# EAGLE design IOB-I2C-PCA9685-PWM (EAGLE 7.7.0)
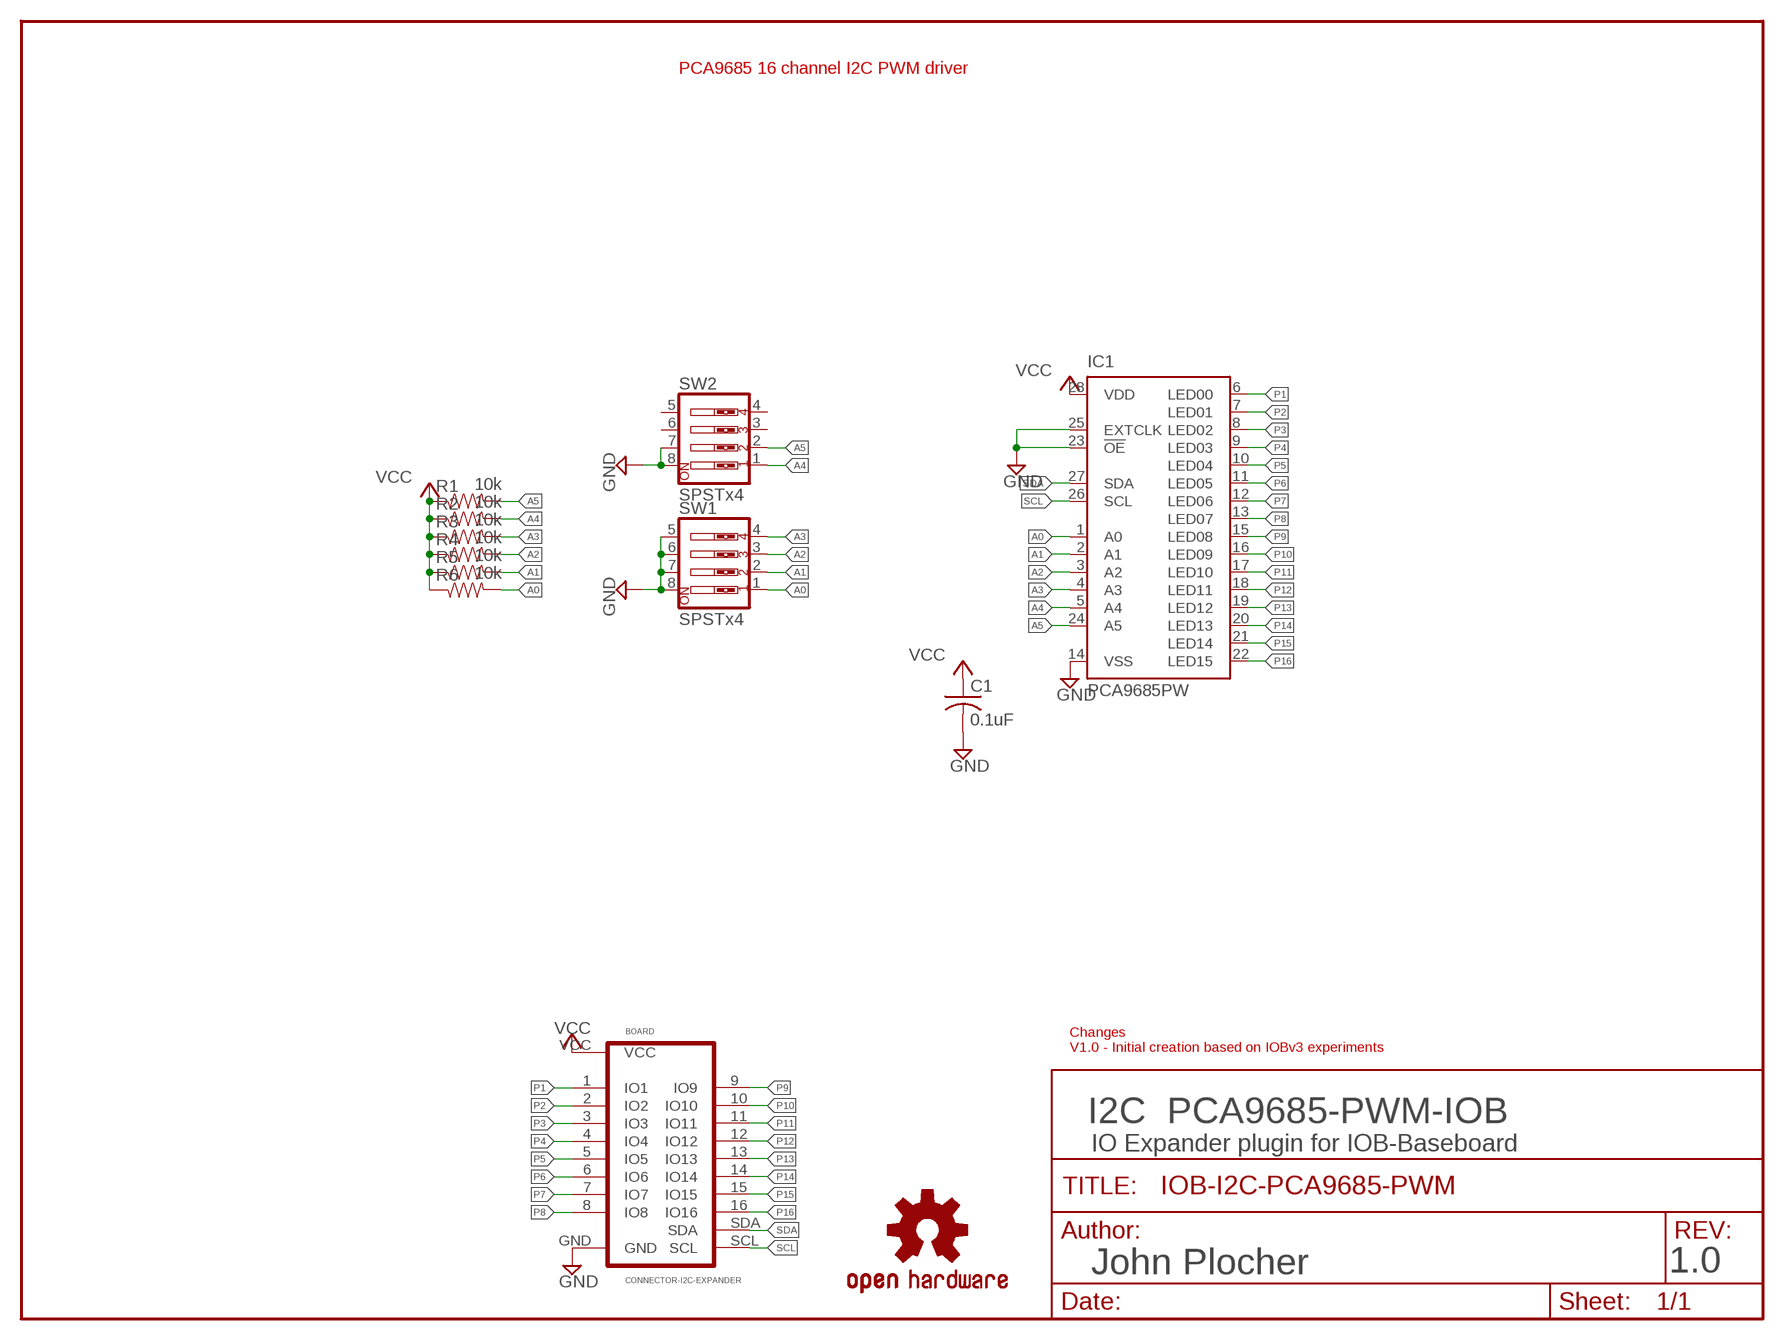
[diagram p0: schematic, sheet 1]

## Parts
BOARD  CONNECTOR-I2C-EXPANDER  [I2C-EXPANDER]
C1  0.1uF  CAP0603  [0603-CAP]
IC1  PCA9685PW  [TSSOP28]
R1  10k  R0603-RES  [0603-RES]
R2  10k  R0603-RES  [0603-RES]
R3  10k  R0603-RES  [0603-RES]
R4  10k  R0603-RES  [0603-RES]
R5  10k  R0603-RES  [0603-RES]
R6  10k  R0603-RES  [0603-RES]
SW1  SPSTx4  SW_DIP-4  [EDG-04]
SW2  SPSTx4  SW_DIP-4  [EDG-04]
U$1  OSHW  DOC-OSHW-LOGO-L  [OSHW-LOGO-L]

## Nets
A0 [signals]: IC1.1(A0) R6.2 SW1.1
A1 [signals]: IC1.2(A1) R5.2 SW1.2
A2 [signals]: IC1.3(A2) R4.2 SW1.3
A3: IC1.4(A3) R3.2 SW1.4
A4: IC1.5(A4) R2.2 SW2.1
A5: IC1.24(A5) R1.2 SW2.2
GND [Power]: BOARD.GND C1.2 IC1.14(VSS) IC1.23(!OE) IC1.25(EXTCLK) SW1.5 SW1.6 SW1.7 SW1.8 SW2.7 SW2.8
P1 [signals]: BOARD.1(IO1) IC1.6(LED00)
P2 [signals]: BOARD.2(IO2) IC1.7(LED01)
P3 [signals]: BOARD.3(IO3) IC1.8(LED02)
P4 [signals]: BOARD.4(IO4) IC1.9(LED03)
P5 [signals]: BOARD.5(IO5) IC1.10(LED04)
P6 [signals]: BOARD.6(IO6) IC1.11(LED05)
P7 [signals]: BOARD.7(IO7) IC1.12(LED06)
P8 [signals]: BOARD.8(IO8) IC1.13(LED07)
P9 [signals]: BOARD.9(IO9) IC1.15(LED08)
P10 [signals]: BOARD.10(IO10) IC1.16(LED09)
P11 [signals]: BOARD.11(IO11) IC1.17(LED10)
P12 [signals]: BOARD.12(IO12) IC1.18(LED11)
P13 [signals]: BOARD.13(IO13) IC1.19(LED12)
P14 [signals]: BOARD.14(IO14) IC1.20(LED13)
P15 [signals]: BOARD.15(IO15) IC1.21(LED14)
P16 [signals]: BOARD.16(IO16) IC1.22(LED15)
SCL [signals]: BOARD.SCL IC1.26(SCL)
SDA [signals]: BOARD.SDA IC1.27(SDA)
VCC [Power]: BOARD.VCC C1.1 IC1.28(VDD) R1.1 R2.1 R3.1 R4.1 R5.1 R6.1
Unconnected: SW2.3 SW2.4 SW2.5 SW2.6

## Notes on the sheet
- PCA9685 16 channel I2C PWM driver
- Changes
  V1.0 - Initial creation based on IOBv3 experiments
- I2C  PCA9685-PWM-IOB
- IO Expander plugin for IOB-Baseboard
- John Plocher | 1.0

## Library data of the parts
BOARD = SPCoast:CONNECTOR-I2C-EXPANDER
C1 = SPCoast:CAP*
IC1 = SPCoast:PCA9685
R1-R6 = SPCoast:R*: Resistor Basic schematic elements and footprints for 0603, 1206, and PTH 1/10th watt (small) resistors.
SW1 SW2 = SPCoast:SW_DIP-4: DIP SWITCH
U$1 = SPCoast:DOC-OSHW-LOGO-: Open Source Hardware Logo This logo indicates the piece of hardware it is found on incorporates a OSHW license and/or adheres to the definition of open source hardware http://freedomdefined.org/OSHW Creative Commons - Attribution - ShareAlike 3.0

## Net classes
0 default: width 0.254 mm, drill 0.4 mm, clearance 0.127 mm
1 Power: width 0.254 mm, drill 0.4 mm, clearance 0.127 mm
2 signals: width 0.254 mm, drill 0.4 mm, clearance 0.127 mm

## Board
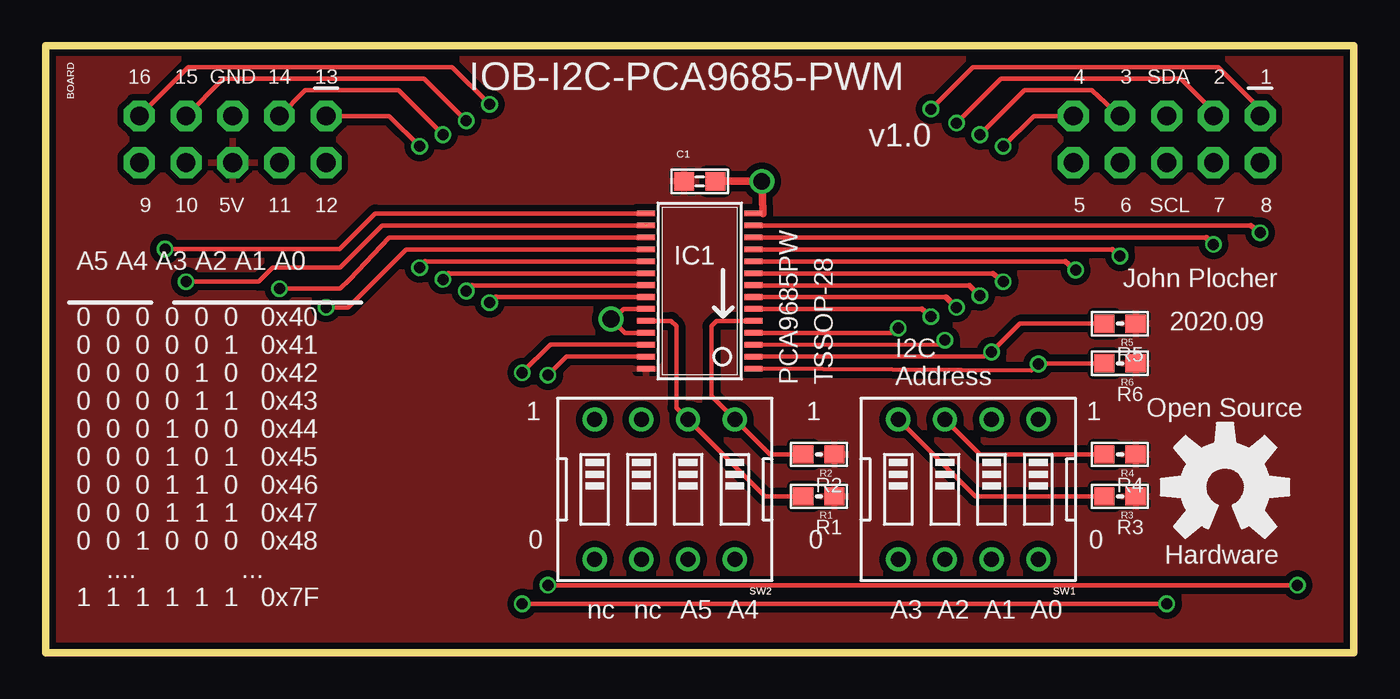
[diagram p1: board, top side]
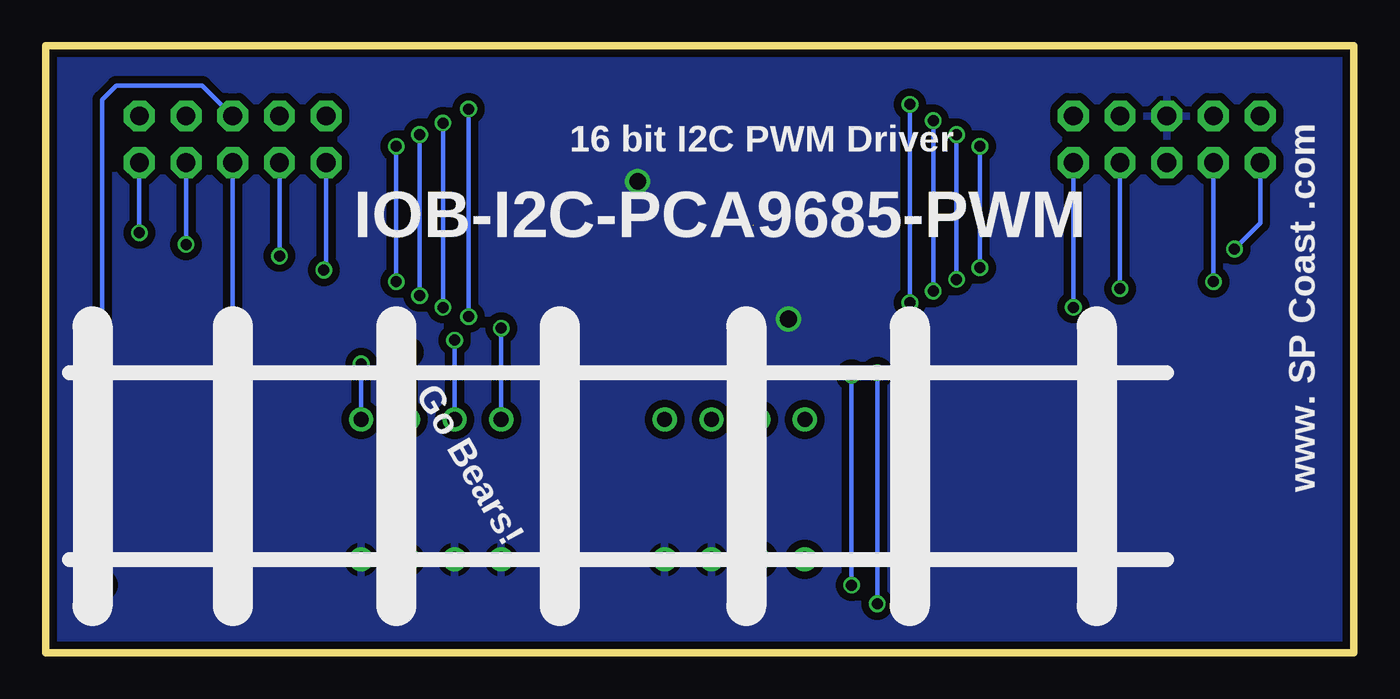
[diagram p2: board, bottom side, seen from below]

Size 71.12 x 33.02 mm. Coordinates in mm from the lower left corner, seen from the top.
Outline: 0,33.02 0,0 71.12,0 71.12,33.02 0,33.02
Copper layers (1*16): Top 0.035mm / dielectric 1.5mm / Bottom 0.035mm
Design rules "Fusion_eagle_rule_v1.1": minimum track width 6mil, minimum drill 12mil, track to track 6mil, track to pad 6mil, pad to pad 6mil, via to via 6mil, smd to smd 0mil, copper to edge 10mil, drill to drill 10mil, minimum pad ring 10mil, minimum via ring 6mil, stop-mask expansion 2mil, vias tented up to drill 100mil, thermal gap 10mil

### Footprints (pad centres in the part's own frame; a part is rotated, then mirrored left to right if it is on the bottom)
I2C-EXPANDER = drill 1.016 pad 1.676 octagon: 1 30.48,1.27; 2 27.94,1.27; 3 22.86,1.27; 4 20.32,1.27; 5 20.32,-1.27; 6 22.86,-1.27; 7 27.94,-1.27; 8 30.48,-1.27; 9 -30.48,-1.27; 10 -27.94,-1.27; 11 -22.86,-1.27; 12 -20.32,-1.27; 13 -20.32,1.27; 14 -22.86,1.27; 15 -27.94,1.27; 16 -30.48,1.27; GND -25.4,1.27; SCL 25.4,-1.27; SDA 25.4,1.27; VCC -25.4,-1.27
0603-CAP = smd 1.1 x 1: 1 -0.85,0; 2 0.85,0
TSSOP28 = smd 0.305 x 0.991: 1 -4.225,-2.918; 2 -3.575,-2.918; 3 -2.925,-2.918; 4 -2.275,-2.918; 5 -1.625,-2.918; 6 -0.975,-2.918; 7 -0.325,-2.918; 8 0.325,-2.918; 9 0.975,-2.918; 10 1.625,-2.918; 11 2.275,-2.918; 12 2.925,-2.918; 13 3.575,-2.918; 14 4.225,-2.918; 15 4.225,2.918; 16 3.575,2.918; 17 2.925,2.918; 18 2.275,2.918; 19 1.625,2.918; 20 0.975,2.918; 21 0.325,2.918; 22 -0.325,2.918; 23 -0.975,2.918; 24 -1.625,2.918; 25 -2.275,2.918; 26 -2.925,2.918; 27 -3.575,2.918; 28 -4.225,2.918
0603-RES = smd 1.1 x 1: 1 -0.85,0; 2 0.85,0
EDG-04 = drill 0.813: 1 -3.81,-3.81; 2 -1.27,-3.81; 3 1.27,-3.81; 4 3.81,-3.81; 5 3.81,3.81; 6 1.27,3.81; 7 -1.27,3.81; 8 -3.81,3.81

### Placement (x,y rotation side)
BOARD  35.56,27.94 0 top
C1  35.56,25.65 0 top
IC1  35.56,19.68 90 top
R1  42.04,8.51 180 top
R2  42.04,10.79 180 top
R3  58.42,8.51 180 top
R4  58.42,10.79 180 top
R5  58.42,17.91 180 top
R6  58.42,15.75 180 top
SW1  50.16,8.89 180 top
SW2  33.66,8.89 180 top
U$1  64.14,9.02 0 top

### Tracks (layer width: path | path; a pad name or v marks a point on that pad's centre or on a via)
A0  (via drill 0.6)
  Top 0.254: IC1.1 53.59,15.37 53.94,15.71 v53.98,15.71 54.01,15.75 R6.2
  Bottom 0.254: v53.98,15.71 SW1.1
A1  (via drill 0.6)
  Top 0.254: IC1.2 51.05,16.13 51.29,16.36 v51.44,16.36 52.98,17.91 R5.2
  Bottom 0.254: v51.44,16.36 SW1.2
A2  (via drill 0.6)
  Top 0.254: IC1.3 48.51,16.76 48.76,17.01 v48.9,17.01 | R4.2 50.8,10.79 SW1.3
  Bottom 0.254: v48.9,17.01 SW1.3
A3  (via drill 0.6)
  Top 0.254: IC1.4 45.97,17.4 46.24,17.66 v46.35,17.66 | R3.2 50.55,8.51 SW1.4
  Bottom 0.254: v46.35,17.66 SW1.4
A4
  Top 0.254: IC1.5 36.48,18.06 36.2,17.78 36.2,13.97 SW2.1 39.37,10.79 R2.2
A5
  Top 0.254: IC1.24 34.01,18.06 34.29,17.78 34.29,13.34 SW2.2 39.12,8.51 R1.2
GND  (via drill 0.9)
  Top 0.254: IC1.25 31.48,17.41 31.11,17.78 | 31.11,17.78 31.11,18.41 31.41,18.71 IC1.23 | v30.73,18.16 31.11,17.78 | IC1.14 38.99,23.91 39.01,23.89
  Top 0.406: 39.01,23.89 v38.94,25.65 C1.2
  pour Bottom (isolate 0.406, rank 2): 70.48,0.64 70.48,32.38 0.64,32.38 0.64,0.64
P1  (via drill 0.6)
  Top 0.254: v48.13,29.59 50.42,31.88 63.75,31.88 66.04,29.59 BOARD.1 | 47.65,18.7 38.49,18.7 IC1.6
  Top 0.305: 47.65,18.7 v48.13,18.29
  Bottom 0.254: v48.13,18.29 v48.13,29.59
P2  (via drill 0.6)
  Top 0.254: v49.53,28.83 51.94,31.24 61.72,31.24 63.5,29.46 BOARD.2 | 48.94,19.34 38.49,19.34 IC1.7
  Top 0.305: 48.94,19.34 v49.53,18.8
  Bottom 0.254: v49.53,18.8 v49.53,28.83
P3  (via drill 0.6)
  Top 0.254: v50.8,28.19 53.21,30.61 56.9,30.61 BOARD.3 | 50.22,20 38.49,20 IC1.8
  Top 0.305: 50.22,20 v50.8,19.43
  Bottom 0.254: v50.8,19.43 v50.8,28.19
P4  (via drill 0.6)
  Top 0.254: BOARD.4 53.72,29.21 v52.07,27.56 | 51.51,20.64 38.49,20.64 IC1.9
  Top 0.305: 51.51,20.64 v52.07,20.19
  Bottom 0.254: v52.07,27.56 v52.07,20.19
P5  (via drill 0.6)
  Top 0.254: 55.46,21.3 38.49,21.3 IC1.10
  Top 0.305: 55.46,21.3 v56.01,20.83
  Bottom 0.254: BOARD.5 55.88,20.83 v56.01,20.83
P6  (via drill 0.6)
  Top 0.254: 58.01,21.95 38.49,21.95 IC1.11
  Top 0.305: 58.01,21.95 v58.42,21.59
  Bottom 0.254: BOARD.6 v58.42,21.59
P7  (via drill 0.6)
  Top 0.254: 63.11,22.59 38.49,22.59 IC1.12
  Top 0.305: 63.11,22.59 v63.5,22.23
  Bottom 0.254: BOARD.7 v63.5,22.23
P8  (via drill 0.6)
  Top 0.254: 65.54,23.25 38.49,23.25 IC1.13
  Top 0.305: 65.54,23.25 v66.04,22.86
  Bottom 0.254: BOARD.8 v66.04,22.86
P9  (via drill 0.6)
  Top 0.254: IC1.15 17.9,23.91 15.96,21.97 v6.48,21.97
  Bottom 0.254: BOARD.9 5.08,23.37 v6.48,21.97
P10  (via drill 0.6)  (1 unrouted)
  Top 0.254: 32.64,23.24 18.29,23.24 16,20.95 12.32,20.95 11.56,20.19 v7.62,20.19
  Bottom 0.254: BOARD.10 v7.62,20.19
P11  (via drill 0.6)
  Top 0.254: IC1.17 32.63,22.59 18.66,22.59 16.51,20.32 16,19.81 v12.7,19.81
  Bottom 0.254: BOARD.11 v12.7,19.81
P12  (via drill 0.6)
  Top 0.254: IC1.18 32.63,21.95 19.58,21.95 16.43,18.8 v15.24,18.8
  Bottom 0.254: BOARD.12 v15.24,18.8
P13  (via drill 0.6)
  Top 0.254: BOARD.13 18.67,29.21 v20.32,27.56 | 20.61,21.3 32.63,21.3 IC1.19
  Top 0.305: 20.61,21.3 v20.32,20.95
  Bottom 0.254: v20.32,27.56 v20.32,20.95
P14  (via drill 0.6)
  Top 0.254: BOARD.14 14.1,30.61 19.18,30.61 v21.59,28.19 | 21.9,20.64 32.63,20.64 IC1.20
  Top 0.305: 21.9,20.64 v21.59,20.32
  Bottom 0.254: v21.59,28.19 v21.59,20.32
P15  (via drill 0.6)
  Top 0.254: BOARD.15 9.65,31.24 20.57,31.24 v22.86,28.96 | 23.18,20 32.63,20 IC1.21
  Top 0.305: 23.18,20 v22.86,19.68
  Bottom 0.254: v22.86,28.96 v22.86,19.68
P16  (via drill 0.6)
  Top 0.254: BOARD.16 7.75,31.88 22.1,31.88 v24.13,29.84 | 24.47,19.34 32.63,19.34 IC1.22
  Top 0.305: 24.47,19.34 v24.13,19.05
  Bottom 0.254: v24.13,29.84 v24.13,19.05
SCL  (via drill 0.6)
  Top 0.254: IC1.26 27.43,16.76 v25.91,15.24 | v60.96,2.67 v25.91,2.67
  Bottom 0.254: v25.91,15.24 v25.91,2.67 | BOARD.SCL v60.96,2.67
SDA  (via drill 0.6)
  Top 0.254: IC1.27 28.3,16.11 v27.3,15.11 | v68.07,3.68 v27.3,3.68
  Bottom 0.254: v27.3,15.11 v27.3,3.68 | BOARD.SDA 62.61,30.86 67.31,30.86 68.07,30.1 v68.07,3.68
VCC
  pour Top (isolate 0.356, rank 2): 70.48,0.64 70.48,32.38 0.64,32.38 0.64,0.64

### Text on the board
tPlace: IOB-I2C-PCA9685-PWM | v1.0 | John Plocher | 2020.09 | PCA9685PW | TSSOP-28 | I2C / Address | 1 | 1 | 1 | Open Source | 0 | 0 | 0 | Hardware | A5 A4 A3 A2 A1 A0 / / 0 0 0 0 0 0 0x40 / 0 0 0 0 0 1 0x41 / 0 0 0 0 1 0 0x42 / 0 0 0 0 1 1 0x43 / 0 0 0 1 0 0 0x44 / 0 0 0 1 0 1 0x45 / 0 0 0 1 1 0 0x46 / 0 0 0 1 1 1 0x47 / 0 0 1 0 0 0 0x48 / .... ... / 1 1 1 1 1 1 0x7F | nc | nc | A5 | A4 | A3 | A2 | A1 | A0
bPlace: www. SP Coast .com | 16 bit I2C PWM Driver | Go Bears!
_tNames: BOARD | C1 | IC1 | R5 | R6 | R2 | R4 | R1 | R3 | SW2 | SW1